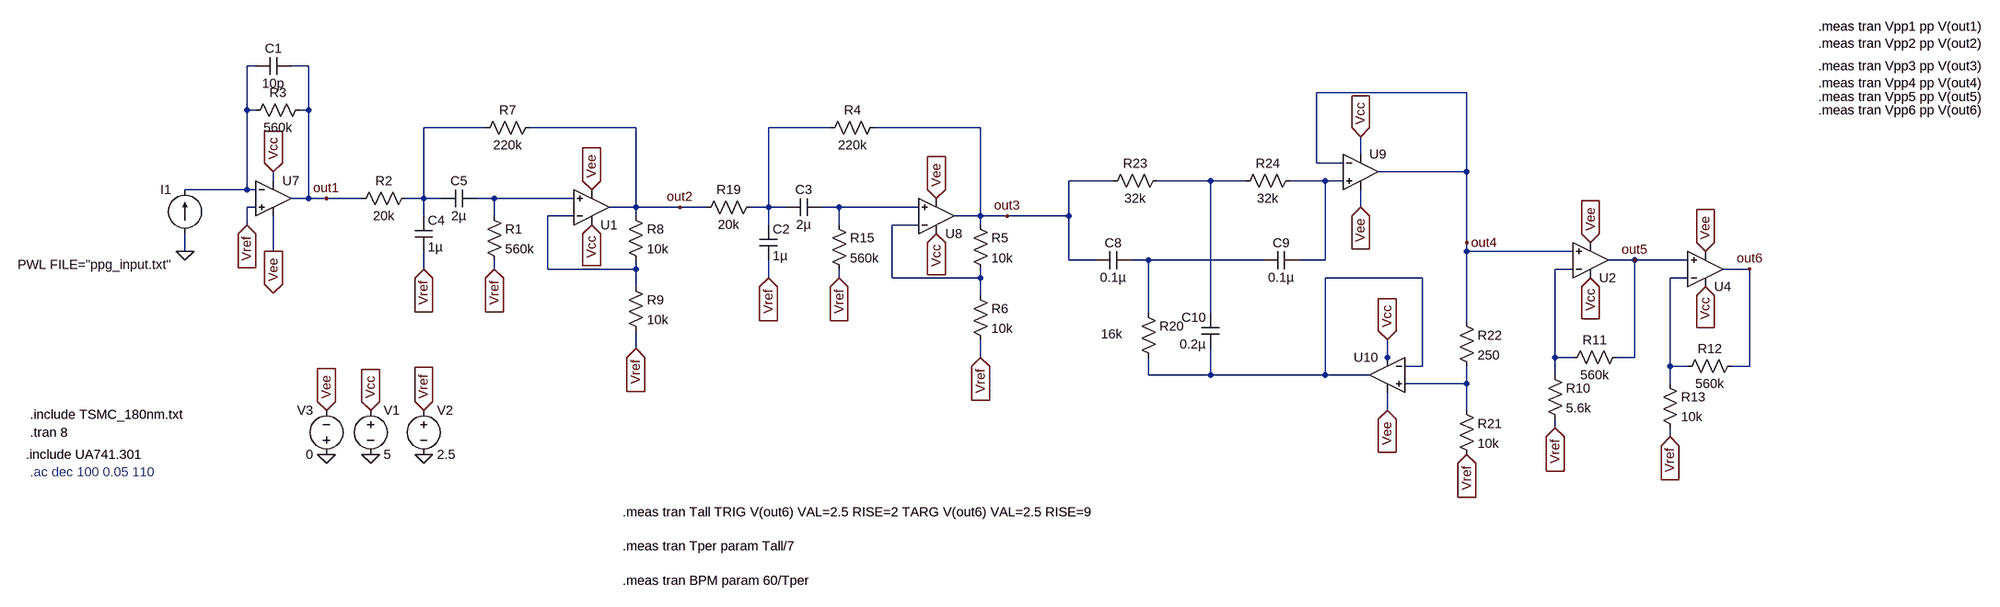
[diagram p0: schematic Ckt.asc]
Ckt.asc, the LTspice schematic file:
Version 4
SHEET 1 4220 1060
WIRE 128 -96 112 -96
WIRE 224 -96 192 -96
WIRE 2320 -48 2048 -48
WIRE 112 -16 112 -96
WIRE 128 -16 112 -16
WIRE 224 -16 224 -96
WIRE 224 -16 208 -16
WIRE 544 16 432 16
WIRE 816 16 624 16
WIRE 1168 16 1056 16
WIRE 1440 16 1248 16
WIRE 2128 64 2128 32
WIRE 2048 80 2048 -48
WIRE 2096 80 2048 80
WIRE 2320 96 2320 -48
WIRE 2320 96 2160 96
WIRE 160 112 160 96
WIRE 1680 112 1600 112
WIRE 1856 112 1760 112
WIRE 1920 112 1856 112
WIRE 2064 112 2000 112
WIRE 2096 112 2064 112
WIRE 112 128 112 -16
WIRE 112 128 0 128
WIRE 128 128 112 128
WIRE 224 144 224 -16
WIRE 224 144 192 144
WIRE 256 144 224 144
WIRE 320 144 256 144
WIRE 432 144 432 16
WIRE 432 144 400 144
WIRE 464 144 432 144
WIRE 560 144 528 144
WIRE 704 144 560 144
WIRE 128 160 112 160
WIRE 816 160 816 16
WIRE 816 160 768 160
WIRE 896 160 816 160
WIRE 944 160 896 160
WIRE 1056 160 1056 16
WIRE 1056 160 1024 160
WIRE 1088 160 1056 160
WIRE 1184 160 1152 160
WIRE 1328 160 1184 160
WIRE 2128 160 2128 128
WIRE 432 176 432 144
WIRE 560 176 560 144
WIRE 704 176 656 176
WIRE 816 176 816 160
WIRE 1440 176 1440 16
WIRE 1440 176 1392 176
WIRE 1488 176 1440 176
WIRE 1600 176 1600 112
WIRE 1600 176 1488 176
WIRE 112 192 112 160
WIRE 1056 192 1056 160
WIRE 1184 192 1184 160
WIRE 1328 192 1280 192
WIRE 1440 192 1440 176
WIRE 2320 224 2320 96
WIRE 0 240 0 208
WIRE 160 240 160 176
WIRE 2320 240 2320 224
WIRE 2512 240 2320 240
WIRE 1600 256 1600 176
WIRE 1648 256 1600 256
WIRE 1744 256 1712 256
WIRE 1952 256 1744 256
WIRE 2064 256 2064 112
WIRE 2064 256 2016 256
WIRE 2624 256 2576 256
WIRE 2720 256 2624 256
WIRE 432 272 432 240
WIRE 560 272 560 256
WIRE 656 272 656 176
WIRE 816 272 816 256
WIRE 816 272 656 272
WIRE 2512 272 2480 272
WIRE 2832 272 2784 272
WIRE 1056 288 1056 256
WIRE 1184 288 1184 272
WIRE 1280 288 1280 192
WIRE 1440 288 1440 272
WIRE 1440 288 1280 288
WIRE 2240 288 2064 288
WIRE 2720 288 2688 288
WIRE 816 304 816 272
WIRE 1440 320 1440 288
WIRE 1744 352 1744 256
WIRE 1856 352 1856 112
WIRE 2320 368 2320 240
WIRE 816 416 816 384
WIRE 1440 432 1440 400
WIRE 2176 432 2176 400
WIRE 2480 432 2480 272
WIRE 2512 432 2480 432
WIRE 2624 432 2624 256
WIRE 2624 432 2592 432
WIRE 2176 448 2176 432
WIRE 2240 448 2240 288
WIRE 2240 448 2208 448
WIRE 2688 448 2688 288
WIRE 2720 448 2688 448
WIRE 2832 448 2832 272
WIRE 2832 448 2800 448
WIRE 1744 464 1744 432
WIRE 1856 464 1856 416
WIRE 1856 464 1744 464
WIRE 2064 464 2064 288
WIRE 2064 464 1856 464
WIRE 2144 464 2064 464
WIRE 2480 464 2480 432
WIRE 2320 480 2320 448
WIRE 2320 480 2208 480
WIRE 2688 480 2688 448
WIRE 2176 528 2176 496
WIRE 2320 528 2320 480
WIRE 2480 560 2480 544
WIRE 2688 576 2688 560
FLAG 0 240 0
FLAG 336 608 0
FLAG 160 96 Vcc
IOPIN 160 96 In
FLAG 432 608 0
FLAG 1360 208 Vcc
IOPIN 1360 208 In
FLAG 256 608 0
FLAG 256 528 Vee
IOPIN 256 528 In
FLAG 1360 144 Vee
IOPIN 1360 144 In
FLAG 160 240 Vee
IOPIN 160 240 Out
FLAG 256 144 out1
FLAG 1488 176 out3
FLAG 2320 224 out4
FLAG 736 192 Vcc
IOPIN 736 192 In
FLAG 736 128 Vee
IOPIN 736 128 In
FLAG 896 160 out2
FLAG 1056 288 Vref
IOPIN 1056 288 In
FLAG 1184 288 Vref
IOPIN 1184 288 In
FLAG 1440 432 Vref
IOPIN 1440 432 In
FLAG 2320 608 Vref
IOPIN 2320 608 In
FLAG 2128 32 Vcc
IOPIN 2128 32 In
FLAG 2176 400 Vcc
IOPIN 2176 400 In
FLAG 2128 160 Vee
IOPIN 2128 160 In
FLAG 2176 528 Vee
IOPIN 2176 528 In
FLAG 112 192 Vref
IOPIN 112 192 In
FLAG 432 272 Vref
IOPIN 432 272 In
FLAG 560 272 Vref
IOPIN 560 272 In
FLAG 816 416 Vref
IOPIN 816 416 In
FLAG 2544 288 Vcc
IOPIN 2544 288 In
FLAG 2544 224 Vee
IOPIN 2544 224 In
FLAG 2480 560 Vref
IOPIN 2480 560 In
FLAG 2624 256 out5
FLAG 2752 304 Vcc
IOPIN 2752 304 In
FLAG 2752 240 Vee
IOPIN 2752 240 In
FLAG 2688 576 Vref
IOPIN 2688 576 In
FLAG 2832 272 out6
FLAG 336 528 Vcc
IOPIN 336 528 In
FLAG 432 528 Vref
IOPIN 432 528 In
SYMBOL current 0 208 R180
WINDOW 0 24 80 Left 2
WINDOW 3 24 -56 Left 2
WINDOW 123 24 -28 Left 2
WINDOW 39 0 0 Left 0
SYMATTR InstName I1
SYMATTR Value PWL FILE="ppg_input.txt"
SYMBOL voltage 336 512 R0
SYMATTR InstName V1
SYMATTR Value 5
SYMBOL res 224 -32 R90
WINDOW 0 0 56 VBottom 2
WINDOW 3 32 56 VTop 2
SYMATTR InstName R3
SYMATTR Value 560k
SYMBOL cap 192 -112 R90
WINDOW 0 0 32 VBottom 2
WINDOW 3 32 32 VTop 2
SYMATTR InstName C1
SYMATTR Value 10p
SYMBOL OpAmps\\UniversalOpAmp2 160 144 R0
SYMATTR InstName U7
SYMBOL voltage 432 512 R0
WINDOW 123 0 0 Left 0
WINDOW 39 0 0 Left 0
SYMATTR InstName V2
SYMATTR Value 2.5
SYMBOL OpAmps\\UniversalOpAmp2 1360 176 M180
SYMATTR InstName U8
SYMBOL res 1168 176 R0
SYMATTR InstName R15
SYMATTR Value 560k
SYMBOL voltage 256 624 R180
WINDOW 0 24 96 Left 2
WINDOW 3 24 16 Left 2
WINDOW 123 0 0 Left 0
WINDOW 39 0 0 Left 0
SYMATTR InstName V3
SYMATTR Value 0
SYMBOL res 1040 144 R90
WINDOW 0 0 56 VBottom 2
WINDOW 3 32 56 VTop 2
SYMATTR InstName R19
SYMATTR Value 20k
SYMBOL cap 1712 240 R90
WINDOW 0 0 32 VBottom 2
WINDOW 3 32 32 VTop 2
SYMATTR InstName C8
SYMATTR Value 0.1µ
SYMBOL cap 2016 240 R90
WINDOW 0 0 32 VBottom 2
WINDOW 3 32 32 VTop 2
SYMATTR InstName C9
SYMATTR Value 0.1µ
SYMBOL cap 1872 416 R180
WINDOW 0 24 56 Left 2
WINDOW 3 24 8 Left 2
SYMATTR InstName C10
SYMATTR Value 0.2µ
SYMBOL res 1728 336 R0
WINDOW 3 -70 54 Left 2
SYMATTR Value 16k
SYMATTR InstName R20
SYMBOL res 2304 512 R0
SYMATTR InstName R21
SYMATTR Value 10k
SYMBOL res 2304 352 R0
SYMATTR InstName R22
SYMATTR Value 250
SYMBOL res 1776 96 R90
WINDOW 0 0 56 VBottom 2
WINDOW 3 32 56 VTop 2
SYMATTR InstName R23
SYMATTR Value 32k
SYMBOL res 2016 96 R90
WINDOW 0 0 56 VBottom 2
WINDOW 3 32 56 VTop 2
SYMATTR InstName R24
SYMATTR Value 32k
SYMBOL OpAmps\\UniversalOpAmp2 2128 96 R0
SYMATTR InstName U9
SYMBOL OpAmps\\UniversalOpAmp2 2176 464 M0
SYMATTR InstName U10
SYMBOL cap 1040 192 R0
SYMATTR InstName C2
SYMATTR Value 1µ
SYMBOL res 1264 0 R90
WINDOW 0 0 56 VBottom 2
WINDOW 3 32 56 VTop 2
SYMATTR InstName R4
SYMATTR Value 220k
SYMBOL cap 1152 144 R90
WINDOW 0 0 32 VBottom 2
WINDOW 3 32 32 VTop 2
SYMATTR InstName C3
SYMATTR Value 2µ
SYMBOL res 1424 176 R0
SYMATTR InstName R5
SYMATTR Value 10k
SYMBOL res 1424 304 R0
SYMATTR InstName R6
SYMATTR Value 10k
SYMBOL OpAmps\\UniversalOpAmp2 736 160 M180
SYMATTR InstName U1
SYMBOL res 544 160 R0
SYMATTR InstName R1
SYMATTR Value 560k
SYMBOL res 416 128 R90
WINDOW 0 0 56 VBottom 2
WINDOW 3 32 56 VTop 2
SYMATTR InstName R2
SYMATTR Value 20k
SYMBOL cap 416 176 R0
SYMATTR InstName C4
SYMATTR Value 1µ
SYMBOL res 640 0 R90
WINDOW 0 0 56 VBottom 2
WINDOW 3 32 56 VTop 2
SYMATTR InstName R7
SYMATTR Value 220k
SYMBOL cap 528 128 R90
WINDOW 0 0 32 VBottom 2
WINDOW 3 32 32 VTop 2
SYMATTR InstName C5
SYMATTR Value 2µ
SYMBOL res 800 160 R0
SYMATTR InstName R8
SYMATTR Value 10k
SYMBOL res 800 288 R0
SYMATTR InstName R9
SYMATTR Value 10k
SYMBOL OpAmps\\UniversalOpAmp2 2544 256 M180
SYMATTR InstName U2
SYMBOL res 2608 416 R90
WINDOW 0 0 56 VBottom 2
WINDOW 3 32 56 VTop 2
SYMATTR InstName R11
SYMATTR Value 560k
SYMBOL res 2464 448 R0
SYMATTR InstName R10
SYMATTR Value 5.6k
SYMBOL OpAmps\\UniversalOpAmp2 2752 272 M180
SYMATTR InstName U4
SYMBOL res 2816 432 R90
WINDOW 0 0 56 VBottom 2
WINDOW 3 32 56 VTop 2
SYMATTR InstName R12
SYMATTR Value 560k
SYMBOL res 2672 464 R0
SYMATTR InstName R13
SYMATTR Value 10k
TEXT -288 608 Left 2 !.include UA741.301
TEXT -280 568 Left 2 !.tran 8
TEXT -280 536 Left 2 !.include TSMC_180nm.txt
TEXT -280 640 Left 2 ;.ac dec 100 0.05 110
TEXT 3896 -168 Left 2 !.meas tran Vpp1 pp V(out1)\n.meas tran Vpp2 pp V(out2)
TEXT 3896 -96 Left 2 !.meas tran Vpp3 pp V(out3)\n.meas tran Vpp4 pp V(out4)
TEXT 3896 -40 Left 2 !.meas tran Vpp5 pp V(out5)
TEXT 3896 -16 Left 2 !.meas tran Vpp6 pp V(out6)
TEXT 792 712 Left 2 !.meas tran Tall TRIG V(out6) VAL=2.5 RISE=2 TARG V(out6) VAL=2.5 RISE=9\n \n.meas tran Tper param Tall/7\n \n.meas tran BPM param 60/Tper

The netlist it stands for:
* Ckt.asc
I1 0 N001 PWL FILE="ppg_input.txt"
V1 Vcc 0 5
R3 out1 N001 560k
C1 out1 N001 10p
XU7 Vref N001 Vcc Vee out1 level2 Avol=1Meg GBW=10Meg Slew=10Meg Ilimit=25m Rail=0 Vos=0 En=0 Enk=0 In=0 Ink=0 Rin=500Meg  ; pins In+ In- V+ V- OUT
V2 Vref 0 2.5
XU8 N007 N009 Vcc Vee out3 level2 Avol=1Meg GBW=10Meg Slew=10Meg Ilimit=25m Rail=0 Vos=0 En=0 Enk=0 In=0 Ink=0 Rin=500Meg  ; pins In+ In- V+ V- OUT
R15 N007 Vref 560k
V3 0 Vee 0
R19 N003 out2 20k
C8 N010 out3 0.1µ
C9 N005 N010 0.1µ
C10 N012 N004 0.2µ
R20 N010 N012 16k
R21 N014 Vref 10k
R22 out4 N014 250
R23 N004 out3 32k
R24 N005 N004 32k
XU9 N005 out4 Vcc Vee out4 level2 Avol=1Meg GBW=10Meg Slew=10Meg Ilimit=25m Rail=0 Vos=0 En=0 Enk=0 In=0 Ink=0 Rin=500Meg  ; pins In+ In- V+ V- OUT
XU10 N014 N012 Vcc Vee N012 level2 Avol=1Meg GBW=10Meg Slew=10Meg Ilimit=25m Rail=0 Vos=0 En=0 Enk=0 In=0 Ink=0 Rin=500Meg  ; pins In+ In- V+ V- OUT
C2 N003 Vref 1µ
R4 out3 N003 220k
C3 N007 N003 2µ
R5 out3 N009 10k
R6 N009 Vref 10k
XU1 N006 N008 Vcc Vee out2 level2 Avol=1Meg GBW=10Meg Slew=10Meg Ilimit=25m Rail=0 Vos=0 En=0 Enk=0 In=0 Ink=0 Rin=500Meg  ; pins In+ In- V+ V- OUT
R1 N006 Vref 560k
R2 N002 out1 20k
C4 N002 Vref 1µ
R7 out2 N002 220k
C5 N006 N002 2µ
R8 out2 N008 10k
R9 N008 Vref 10k
XU2 out4 N011 Vcc Vee out5 level2 Avol=1Meg GBW=10Meg Slew=10Meg Ilimit=25m Rail=0 Vos=0 En=0 Enk=0 In=0 Ink=0 Rin=500Meg  ; pins In+ In- V+ V- OUT
R11 out5 N011 560k
R10 N011 Vref 5.6k
XU4 out5 N013 Vcc Vee out6 level2 Avol=1Meg GBW=10Meg Slew=10Meg Ilimit=25m Rail=0 Vos=0 En=0 Enk=0 In=0 Ink=0 Rin=500Meg  ; pins In+ In- V+ V- OUT
R12 out6 N013 560k
R13 N013 Vref 10k
.include UA741.301
.tran 8
.include TSMC_180nm.txt
* .ac dec 100 0.05 110
.meas tran Vpp1 pp V(out1)
.meas tran Vpp2 pp V(out2)
.meas tran Vpp3 pp V(out3)
.meas tran Vpp4 pp V(out4)
.meas tran Vpp5 pp V(out5)
.meas tran Vpp6 pp V(out6)
.meas tran Tall TRIG V(out6) VAL=2.5 RISE=2 TARG V(out6) VAL=2.5 RISE=9
.meas tran Tper param Tall/7
.meas tran BPM param 60/Tper
.lib UniversalOpAmp2.lib
.backanno
.end